# EAGLE board OSHW_STEPPER_DRIVER (EAGLE 6.2), part 1 of 3
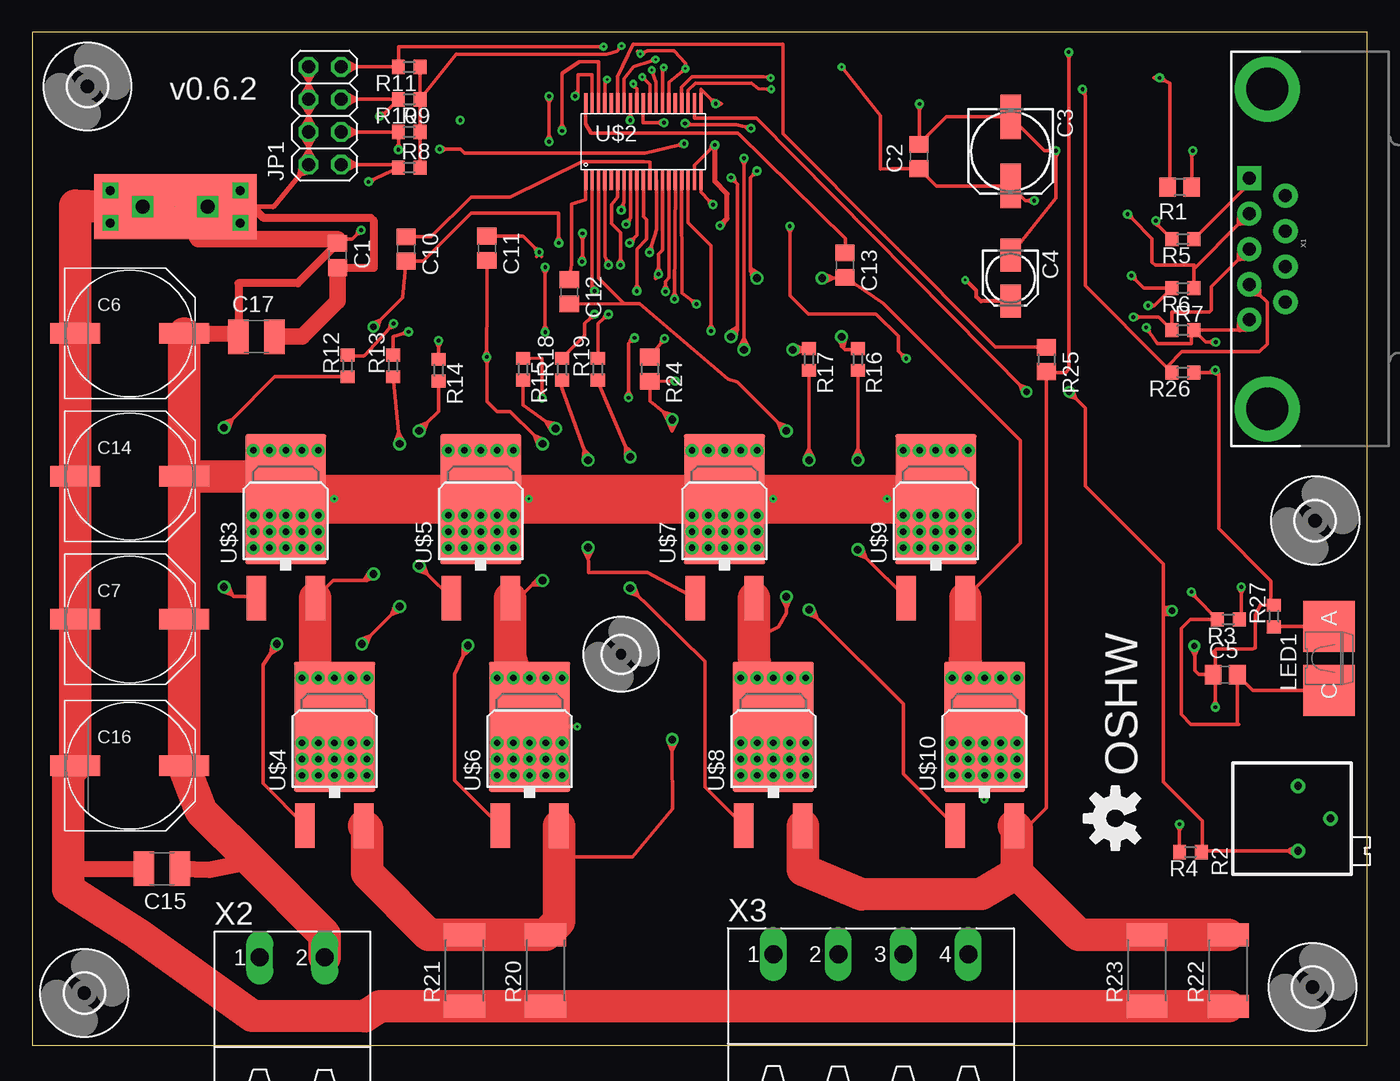
[diagram p1: board, top side]
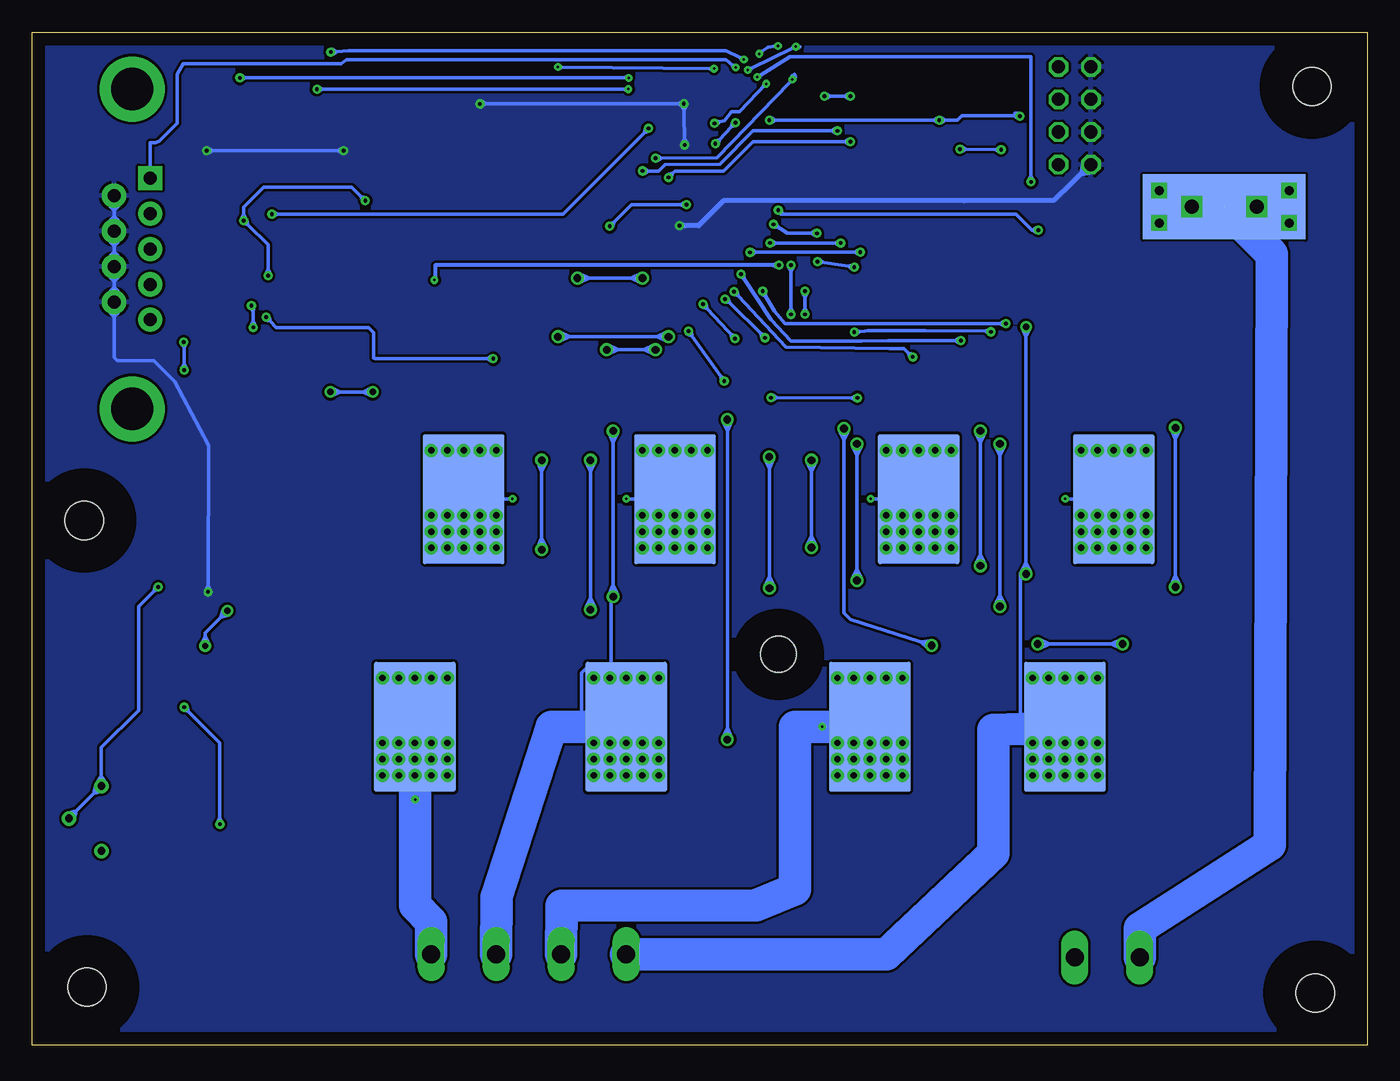
[diagram p2: board, bottom side, seen from below]

Size 104.37 x 79.19 mm. Coordinates in mm from the lower left corner, seen from the top.
Outline: 0.02,0 104.34,0 104.37,79.16 0,79.19 0.02,0
Copper layers (1*16): Top 0.035mm / dielectric 1.5mm / Bottom 0.035mm
Design rules: minimum track width 10mil, minimum drill 0.2mm, track to track 8mil, track to pad 8mil, pad to pad 8mil, via to via 8mil, smd to smd 8mil, copper to edge 40mil, drill to drill 8mil, minimum pad ring 10mil, minimum via ring 8mil, stop-mask expansion 4mil, vias tented up to drill 0mil, thermal gap 10mil
Net classes: 0 default: width 0.254 mm; 1 MOTOR POWER: width 0.254 mm, clearance 0.254 mm; 2 LSS (low impedance): width 0.254 mm, clearance 0.254 mm

## Footprints (pad centres in the part's own frame; a part is rotated, then mirrored left to right if it is on the bottom)
C0805 = smd 1.3 x 1.5: 1 -0.95,0; 2 0.95,0
153CLV-0605 = smd 3.5 x 1.6: + 2.7,0; - -2.7,0
153CLV-0405 = smd 2.6 x 1.6: + 1.8,0; - -1.8,0
PANASONIC_G = smd 3.9 x 1.6: + 4.25,0; - -4.25,0
C1210 = smd 1.6 x 2.7: 1 -1.4,0; 2 1.4,0
3,0 = hole 3: 0,0
2,8 = hole 2.8: 0,0
STARBOARD_GROUND = smd 0.635 x 1.27: 1 0,-5.08; 4 0,5.08 | smd 1.27 x 0.635: 2 0,0 | smd 5.08 x 12.7: P$1 0,0 | smd 5.08 x 12.7 bottom: P$2 0,0 | drill 0.7 square: P$3 1.27,5.08; P$4 -1.27,5.08; P$9 -1.27,-5.08; P$10 1.27,-5.08 | drill 1.1 square: P$5 0,2.54; P$6 0,-2.54
2X04 = drill 1.016 octagon: 1 -3.81,-1.27; 2 -3.81,1.27; 3 -1.27,-1.27; 4 -1.27,1.27; 5 1.27,-1.27; 6 1.27,1.27; 7 3.81,-1.27; 8 3.81,1.27
OSRAM-SIDELED = smd 4 x 4: A 0,2.5; C 0,-2.5
R0805 = smd 1.3 x 1.5: 1 -0.95,0; 2 0.95,0
RTRIM3296P = drill 0.61: 1 0,-2.54; 2 2.54,0; 3 0,2.54
R0603 = smd 1 x 1.1: 1 -0.85,0; 2 0.85,0
R2512 = smd 1.8 x 3.2: 1 -2.8,0; 2 2.8,0
TSSOP38 = smd 0.254 x 1.6: P$1 -4.5,-3; P$2 -4,-3; P$3 -3.5,-3; P$4 -3,-3; P$5 -2.5,-3; P$6 -2,-3; P$7 -1.5,-3; P$8 -1,-3; P$9 -0.5,-3; P$10 0,-3; P$11 0.5,-3; P$12 1,-3; P$13 1.5,-3; P$14 2,-3; P$15 2.5,-3; P$16 3,-3; P$17 3.5,-3; P$18 4,-3; P$19 4.5,-3; P$20 4.5,3; P$21 4,3; P$22 3.5,3; P$23 3,3; P$24 2.5,3; P$25 2,3; P$26 1.5,3; P$27 1,3; P$28 0.5,3; P$29 0,3; P$30 -0.5,3; P$31 -1,3; P$32 -1.5,3; P$33 -2,3; P$34 -2.5,3; P$35 -3,3; P$36 -3.5,3; P$37 -4,3; P$38 -4.5,3
D-PAK_TO252AA = smd 6.35 x 10.16: D 0,2.54 | smd 6.35 x 10.16 bottom: DRAIN-BOTTOM 0,2.54 | smd 1.6 x 3.5: G -2.3,-5.2; S 2.3,-5.2 | drill 0.5 pad 1: P$1 -1.27,6.35; P$2 -2.54,6.35; P$3 0,6.35; P$4 1.27,6.35; P$5 2.54,6.35; P$6 -2.54,1.27; P$7 -1.27,1.27; P$8 0,1.27; P$9 1.27,1.27; P$10 2.54,1.27; P$11 -2.54,0; P$12 -1.27,0; P$13 0,0; P$14 1.27,0; P$15 2.54,0; P$16 -2.54,-1.27; P$17 -1.27,-1.27; P$18 0,-1.27; P$19 1.27,-1.27; P$20 2.54,-1.27
DB9 = drill 1.016 pad 1.88 square: 1 -5.54,-1.42 | drill 1.016 pad 1.88: 2 -2.77,-1.42; 3 0,-1.42; 4 2.77,-1.42; 5 5.54,-1.42; 6 -4.15,1.42; 7 -1.38,1.42; 8 1.38,1.42; 9 4.15,1.42 | drill 3.302 pad 5.08: G1 -12.5,0; G2 12.5,0
MSTBA2 = drill 1.397 long: 1 -2.54,5.08; 2 2.54,5.08
MSTBA4 = drill 1.397 long: 1 -7.62,5.08; 2 -2.54,5.08; 3 2.54,5.08; 4 7.62,5.08

## Placement (x,y rotation side)
C1  100n  [C0805]  23.9,61.72 270 top
C2  100n  [C0805]  69.31,69.45 90 top
C3  100u  [153CLV-0605]  76.47,69.85 270 top
C4  1u  [153CLV-0405]  76.47,59.94 270 top
C5  100n  [C0805]  93.24,28.96 0 top
C6  100u (747-9090)  [PANASONIC_G]  7.64,55.63 0 top
C7  100u (747-9090)  [PANASONIC_G]  7.64,33.27 0 top
C10  10n  [C0805]  29.23,62.23 270 top
C11  10n  [C0805]  35.55,62.28 270 top
C12  10n  [C0805]  41.99,58.88 270 top
C13  10n  [C0805]  63.52,60.96 270 top
C14  100u (747-9090)  [PANASONIC_G]  7.64,44.45 0 top
C15  100n  [C1210]  10.16,13.79 180 top
C16  100u (747-9090)  [PANASONIC_G]  7.64,21.84 0 top
C17  100n  [C1210]  17.55,55.37 0 top
H1  MOUNT-HOLE3.0  [3,0]  100.06,4.54 0 top
H2  MOUNT-HOLE3.0  [3,0]  4.34,74.93 0 top
H3  MOUNT-HOLE3.0  [3,0]  4.09,4.08 0 top
H4  MOUNT-HOLE3.0  [3,0]  100.28,41 0 top
H5  MOUNT-HOLE2.8  [2,8]  46.04,30.55 0 top
J1  [STARBOARD_GROUND]  11.2,65.53 270 top
JP1  [2X04]  22.88,72.64 90 top
LED1  [OSRAM-SIDELED]  101.37,30.23 0 top
R1  10K 10ppm (662-1252)  [R0805]  89.68,67.06 180 top
R2  20K (522-0142)  [RTRIM3296P]  98.94,17.72 0 top
R3  10K  [R0603]  93.49,33.27 180 top
R4  22K  [R0603]  90.53,15.09 180 top
R5  10k  [R0603]  89.94,62.99 180 top
R6  10k  [R0603]  89.94,59.18 180 top
R7  10k  [R0603]  89.94,55.88 0 top
R8  10k  [R0603]  29.48,68.58 0 top
R9  10k  [R0603]  29.48,71.37 0 top
R10  10k  [R0603]  29.48,73.91 180 top
R11  10k  [R0603]  29.48,76.45 180 top
R12  33  [R0603]  24.66,53.09 90 top
R13  33  [R0603]  28.21,53.09 90 top
R14  33  [R0603]  31.79,52.75 270 top
R15  33  [R0603]  38.37,52.83 270 top
R16  33  [R0603]  64.54,53.59 270 top
R17  33  [R0603]  60.73,53.59 270 top
R18  33  [R0603]  41.42,52.83 90 top
R19  33  [R0603]  44.22,52.83 90 top
R20  0.1  [R2512]  40.15,5.84 90 top
R21  0.1  [R2512]  33.8,5.84 90 top
R22  0.1  [R2512]  93.49,5.84 90 top
R23  0.1  [R2512]  87.14,5.84 90 top
R24  0  [R0805]  48.28,52.83 270 top
R25  0  [R0805]  79.27,53.59 270 top
R26  10k  [R0603]  89.94,52.58 180 top
R27  180  [R0603]  97.05,33.53 90 top
U$1  OSHW-LOGOM  [OSHW-LOGO-M]  84.66,17.73 90 top
U$2  A4989  [TSSOP38]  47.77,70.61 0 top
U$3  IRLR024  [D-PAK_TO252AA]  19.83,40.13 0 top
U$4  IRLR024  [D-PAK_TO252AA]  23.64,22.35 0 top
U$5  IRLR024  [D-PAK_TO252AA]  35.07,40.13 0 top
U$6  IRLR024  [D-PAK_TO252AA]  38.88,22.35 0 top
U$7  IRLR024  [D-PAK_TO252AA]  54.12,40.13 0 top
U$8  IRLR024  [D-PAK_TO252AA]  57.93,22.35 0 top
U$9  IRLR024  [D-PAK_TO252AA]  70.63,40.13 0 top
U$10  IRLR024  [D-PAK_TO252AA]  74.44,22.35 0 top
X1  [DB9]  96.54,62.23 270 top
X2  MSTBA2  [MSTBA2]  20.34,1.78 0 top
X3  MSTBA4  [MSTBA4]  65.55,2.03 0 top

## Tracks (layer width: path | path; a pad name or v marks a point on that pad's centre or on a via)
C1A
  Top 0.254: C10.1 31.2,63.18 34.31,66.29 37.36,66.29 43,69.05 47.82,69.05 48.28,68.99 U$2.P$11
C1B  (via drill 0.3)
  Top 0.254: C11.1 38.37,63.23 39.32,62.29 | 39.32,62.29 | 39.32,62.29 v39.64,61.98 | v48.27,61.96 48.79,63.75 48.79,67.6 U$2.P$12 | 39.32,62.29 39.43,61.92 | 39.43,61.92 | 39.32,62.29 | 39.32,62.29 39.43,61.92 | v39.64,61.98 39.43,61.92 | 39.32,62.29 39.7,62.2 | v39.64,61.98 39.7,62.2 | v39.64,61.98 39.45,61.64 | v39.64,61.98 39.84,61.64 | 39.32,62.29 | 39.32,62.29 39.43,61.92 | 39.32,62.29 39.7,62.2 | 39.32,62.29 39.43,61.92 | v39.64,61.98 39.43,61.92 | 39.32,62.29 39.7,62.2 | v39.64,61.98 39.7,62.2 | v48.27,61.96 48.11,62.13 48.39,62.39 48.49,62.02 v48.27,61.96
  Bottom 0.254: v39.64,61.98 40.09,61.98 | 40.09,61.98 v48.27,61.96 | 40.09,61.98 39.76,62.17 v39.64,61.98 | 40.09,61.98 39.76,61.78 v39.64,61.98 | v48.27,61.96 48.15,61.77 47.82,61.96 48.15,62.16 v48.27,61.96
C2A
  Top 0.254: C12.1 42.18,60.99 42.18,65.74 43.27,66.09 U$2.P$1
C2B
  Top 0.254: C13.1 63.56,63.04 55.16,71.27 43.7,71.26 43.27,72.04 43.27,72.64 U$2.P$38
DIR  (via drill 0.2, 0.3)
  Top 0.254: U$2.P$30 47.27,74.76 47.13,74.87 | 47.13,74.87 46.97,75 v46.99,75.14 | v51.04,72.04 51.35,71.94 51.48,71.94 | 51.48,71.94 55.07,71.94 v56.2,71.65 | v85.62,64.95 85.94,64.63 | 85.94,64.63 87.52,63.05 87.52,61.2 87.77,60.95 90.82,60.95 90.79,60.92 90.79,60.67 | 90.79,60.67 R6.1 | X1.2 94.4,64.28 90.79,60.67 | 46.91,74.98 | 47.13,74.87 | 47.13,74.87 | 47.13,74.87 46.91,74.98 | 46.91,74.98 | 47.13,74.87 46.91,74.98 | 46.91,74.98 | 47.13,74.87 47.16,75.11 | 47.16,75.11 | v46.99,75.14 47.16,75.11 | 47.13,74.87 46.91,74.98 | v46.99,75.14 46.91,74.98 | 47.13,74.87 47.16,75.11 | v46.99,75.14 47.16,75.11 | 47.13,74.87 46.91,74.98 | v46.99,75.14 46.91,74.98 | 51.48,71.94 51.19,72.2 v51.04,72.04 | 51.48,71.94 51.11,71.82 v51.04,72.04 | v56.2,71.65 56.04,71.49 55.76,71.76 56.14,71.87 v56.2,71.65 | 85.94,64.63 85.84,65.01 v85.62,64.95 | 85.94,64.63 85.56,64.73 v85.62,64.95
  Top 0.508: 94.4,64.28 95.15,64.31 X1.2 94.44,65.03 94.4,64.28
  Bottom 0.254: v46.99,75.14 49.07,72.95 49.72,72.95 50.26,72.26 50.61,72.16 | 50.61,72.16 v51.04,72.04 | v56.2,71.65 56.52,71.33 | 56.52,71.33 62.87,64.95 85.17,64.95 | 85.17,64.95 | 85.17,64.95 v85.62,64.95 | 50.61,72.16 50.98,72.26 | 50.98,72.26 | v46.99,75.14 47.17,75.16 47.2,74.92 46.96,74.97 v46.99,75.14 | 50.61,72.16 50.88,71.88 v51.04,72.04 | 50.61,72.16 50.98,72.26 | v51.04,72.04 50.98,72.26 | 56.52,71.33 56.42,71.71 v56.2,71.65 | 56.52,71.33 56.14,71.43 v56.2,71.65 | 85.17,64.95 85.51,65.15 | 85.17,64.95 | 85.17,64.95 85.51,64.75 | v85.62,64.95 85.51,64.75 | 85.17,64.95 85.51,65.15 | 85.17,64.95 | 85.17,64.95 85.51,64.75 | 85.17,64.95 | 85.17,64.95 85.51,65.15 | v85.62,64.95 85.51,65.15 | 85.17,64.95 85.51,64.75 | v85.62,64.95 85.51,64.75 | 85.17,64.95 85.51,65.15 | v85.62,64.95 85.51,65.15 | 85.17,64.95 85.51,64.75 | 85.17,64.95 85.51,65.15 | 85.17,64.95 85.51,64.75 | v85.62,64.95 85.51,64.75 | 85.17,64.95 85.51,65.15 | v85.62,64.95 85.51,65.15
ENABLE  (via drill 0.3)
  Top 0.254: U$2.P$19 52.27,66.65 52.9,66.02 | 52.9,66.02 v53.22,65.7 | v59.22,64 59.22,63.55 | 59.22,63.55 | 59.22,63.55 59.22,58.6 60.67,57.15 65.97,57.15 67.72,55.4 67.72,54.25 68,53.97 | X1.3 94.4,61.51 92.17,59.28 92.17,57.45 92.02,57.3 89.07,57.3 89.09,57.28 R7.1 88.12,56.85 88.04,56.91 87.77,56.9 86.52,56.9 | 86.52,56.9 | 86.52,56.9 v86.07,56.9 | v68.32,53.65 68,53.97 | 52.9,66.02 53,65.64 v53.22,65.7 | 52.9,66.02 53.28,65.92 v53.22,65.7 | 59.22,63.55 59.42,63.89 | 59.22,63.55 | 59.22,63.55 59.42,63.89 | v59.22,64 59.42,63.89 | 59.22,63.55 | 59.22,63.55 59.02,63.89 | 59.22,63.55 59.42,63.89 | 59.22,63.55 | 59.22,63.55 59.02,63.89 | v59.22,64 59.02,63.89 | 59.22,63.55 59.42,63.89 | 59.22,63.55 59.02,63.89 | 59.22,63.55 59.42,63.89 | v59.22,64 59.42,63.89 | 59.22,63.55 59.02,63.89 | v59.22,64 59.02,63.89 | 59.22,63.55 59.42,63.89 | v59.22,64 59.42,63.89 | 59.22,63.55 59.02,63.89 | v59.22,64 59.02,63.89 | 86.52,56.9 86.18,57.1 | 86.52,56.9 | 86.52,56.9 86.18,57.1 | v86.07,56.9 86.18,57.1 | 86.52,56.9 | 86.52,56.9 86.18,56.7 | 86.52,56.9 86.18,57.1 | 86.52,56.9 | 86.52,56.9 86.18,56.7 | v86.07,56.9 86.18,56.7 | 86.52,56.9 86.18,57.1 | 86.52,56.9 86.18,56.7 | 86.52,56.9 86.18,57.1 | v86.07,56.9 86.18,57.1 | 86.52,56.9 86.18,56.7 | v86.07,56.9 86.18,56.7 | 86.52,56.9 86.18,57.1 | v86.07,56.9 86.18,57.1 | 86.52,56.9 86.18,56.7 | v86.07,56.9 86.18,56.7 | 68,53.97 68.1,53.59 v68.32,53.65 | 68,53.97 68.38,53.87 v68.32,53.65
  Top 0.508: 94.4,61.51 95.15,61.55 X1.3 94.44,62.26 94.4,61.51
  Bottom 0.254: v53.22,65.7 53.67,65.7 | 53.67,65.7 | 53.67,65.7 57.52,65.7 58.9,64.32 | 58.9,64.32 v59.22,64 | v86.07,56.9 85.75,56.58 | 85.75,56.58 85.27,56.1 78.07,56.1 77.67,55.7 77.67,53.7 77.57,53.65 68.77,53.65 | 68.77,53.65 | 68.77,53.65 v68.32,53.65 | 53.67,65.7 53.33,65.9 | 53.67,65.7 | 53.67,65.7 53.33,65.9 | v53.22,65.7 53.33,65.9 | 53.67,65.7 | 53.67,65.7 53.33,65.5 | 53.67,65.7 53.33,65.9 | 53.67,65.7 | 53.67,65.7 53.33,65.5 | v53.22,65.7 53.33,65.5 | 53.67,65.7 53.33,65.9 | 53.67,65.7 53.33,65.5 | 53.67,65.7 53.33,65.9 | v53.22,65.7 53.33,65.9 | 53.67,65.7 53.33,65.5 | v53.22,65.7 53.33,65.5 | 53.67,65.7 53.33,65.9 | v53.22,65.7 53.33,65.9 | 53.67,65.7 53.33,65.5 | v53.22,65.7 53.33,65.5 | 58.9,64.32 59,63.94 v59.22,64 | 58.9,64.32 59.28,64.22 v59.22,64 | 85.75,56.58 86.13,56.68 v86.07,56.9 | 85.75,56.58 85.85,56.96 v86.07,56.9 | 68.77,53.65 68.43,53.85 | 68.77,53.65 | 68.77,53.65 68.43,53.85 | v68.32,53.65 68.43,53.85 | 68.77,53.65 | 68.77,53.65 68.43,53.45 | 68.77,53.65 68.43,53.85 | 68.77,53.65 | 68.77,53.65 68.43,53.45 | v68.32,53.65 68.43,53.45 | 68.77,53.65 68.43,53.85 | 68.77,53.65 68.43,53.45 | 68.77,53.65 68.43,53.85 | v68.32,53.65 68.43,53.85 | 68.77,53.65 68.43,53.45 | v68.32,53.65 68.43,53.45 | 68.77,53.65 68.43,53.85 | v68.32,53.65 68.43,53.85 | 68.77,53.65 68.43,53.45 | v68.32,53.65 68.43,53.45
GH1A  (via drill 0.3)
  Top 0.254: 27.96,56.05 25.99,53.91 26.18,54.1 25.93,53.85 24.66,53.85 R12.2 | 27.96,56.05 v28.26,56.38 | v47.26,58.93 47.26,59.38 | 47.26,59.38 | 47.26,59.38 47.26,62.23 48.03,62.99 48.03,64.52 47.77,64.77 U$2.P$10 | 47.26,59.38 47.46,59.04 | 47.26,59.38 | 47.26,59.38 47.07,59.04 | v47.26,58.93 47.07,59.04 | 47.26,59.38 47.46,59.04 | 47.26,59.38 | 47.26,59.38 47.07,59.04 | 47.26,59.38 | 47.26,59.38 47.46,59.04 | v47.26,58.93 47.46,59.04 | 47.26,59.38 47.07,59.04 | v47.26,58.93 47.07,59.04 | 47.26,59.38 47.46,59.04 | v47.26,58.93 47.46,59.04 | 47.26,59.38 47.07,59.04 | 47.26,59.38 47.46,59.04 | 47.26,59.38 47.07,59.04 | v47.26,58.93 47.07,59.04 | 47.26,59.38 47.46,59.04 | v47.26,58.93 47.46,59.04 | 27.96,56.05 28.33,56.17 v28.26,56.38 | 27.96,56.05 28.04,56.43 v28.26,56.38
  Bottom 0.254: v47.26,58.93 46.33,57.38 45.51,56.38 28.71,56.38 | v28.26,56.38 28.71,56.38 | 28.71,56.38 | 47.04,58.93 | 47.03,58.54 47.37,58.73 | 47.03,58.54 | 47.03,58.54 47.04,58.93 | v47.26,58.93 47.04,58.93 | 47.03,58.54 47.37,58.73 | v47.26,58.93 47.37,58.73 | 47.03,58.54 47.04,58.93 | v47.26,58.93 47.04,58.93 | 28.71,56.38 28.37,56.58 | 28.71,56.38 | 28.71,56.38 28.37,56.58 | v28.26,56.38 28.37,56.58 | 28.71,56.38 | 28.71,56.38 28.37,56.19 | 28.71,56.38 28.37,56.58 | 28.71,56.38 | 28.71,56.38 28.37,56.19 | v28.26,56.38 28.37,56.19 | 28.71,56.38 28.37,56.58 | 28.71,56.38 28.37,56.19 | 28.71,56.38 28.37,56.58 | v28.26,56.38 28.37,56.58 | 28.71,56.38 28.37,56.19 | v28.26,56.38 28.37,56.19 | 28.71,56.38 28.37,56.58 | v28.26,56.38 28.37,56.58 | 28.71,56.38 28.37,56.19 | v28.26,56.38 28.37,56.19
GH1B  (via drill 0.3)
  Top 0.254: U$2.P$13 49.27,62.12 48.97,61.82 48.97,60.72 | 48.97,60.72 v48.96,60.27 | v31.77,55.06 31.78,54.61 | 31.78,54.61 R14.1 | 31.78,54.61 31.97,54.95 | 31.97,54.95 | 49.16,60.38 | 31.78,54.61 31.97,54.95 | v31.77,55.06 31.97,54.95 | 31.78,54.61 31.58,54.94 v31.77,55.06 | v48.96,60.27 49.06,60.07 48.72,59.9 48.74,60.28 v48.96,60.27 | 48.97,60.72 48.77,60.39 | 48.97,60.72 | 48.97,60.72 49.16,60.38 | v48.96,60.27 49.16,60.38 | 48.97,60.72 48.77,60.39 | v48.96,60.27 48.77,60.39 | 48.97,60.72 49.16,60.38 | v48.96,60.27 49.16,60.38
  Bottom 0.254: v48.96,60.27 48.72,59.9 | 48.72,59.9 46.63,56.7 45.07,55.04 39.55,55.02 37.42,55.08 v31.77,55.06 | 32.22,55.06 31.88,54.87 | v31.77,55.06 31.88,54.87 | 32.22,55.06 31.88,55.26 v31.77,55.06 | 32.22,55.06 31.88,54.87 | v31.77,55.06 31.88,54.87 | 48.72,59.9 | 48.72,59.9 49.06,60.07 | 49.06,60.07 | 48.72,59.9 | 48.72,59.9 48.74,60.28 | 48.74,60.28 | 48.72,59.9 49.06,60.07 | 49.06,60.07 | v48.96,60.27 49.06,60.07 | 48.72,59.9 48.74,60.28 | v48.96,60.27 48.74,60.28 | 48.72,59.9 49.06,60.07 | v48.96,60.27 49.06,60.07 | 48.72,59.9 48.74,60.28 | v48.96,60.27 48.74,60.28
GH2A  (via drill 0.3)
  Top 0.254: U$2.P$2 43.77,59.34 | 43.77,59.34 43.77,59.12 v43.96,58.93 | v43.96,57.12 43.64,56.81 | 43.64,56.81 | 43.64,56.81 43.2,56.39 43.2,55.46 R18.2 | 43.64,56.81 | 43.64,56.81 | 43.64,56.81 43.75,57.18 | 43.75,57.18 | 43.64,56.81 44.02,56.9 | 44.02,56.9 | 43.64,56.81 | 43.64,56.81 44.02,56.9 | 44.02,56.9 | 43.64,56.81 | 43.64,56.81 | 43.64,56.81 44.02,56.9 | 44.02,56.9 | 43.64,56.81 | 43.75,57.18 | v43.96,57.12 43.75,57.18 | 43.77,59.34 43.74,58.95 v43.96,58.93 | 43.77,59.34 44.09,59.11 v43.96,58.93 | 43.64,56.81 43.75,57.18 | 43.64,56.81 43.75,57.18 | 43.75,57.18 | 43.64,56.81 43.75,57.18 | 43.75,57.18 | 43.64,56.81 43.75,57.18 | v43.96,57.12 43.75,57.18 | 43.64,56.81 44.02,56.9 | 43.64,56.81 43.75,57.18 | 43.64,56.81 44.02,56.9 | 44.02,56.9 | v43.96,57.12 44.02,56.9 | 43.64,56.81 43.75,57.18 | v43.96,57.12 43.75,57.18 | 43.64,56.81 44.02,56.9 | v43.96,57.12 44.02,56.9 | 43.64,56.81 43.75,57.18 | v43.96,57.12 43.75,57.18
  Bottom 0.254: v43.96,58.93 43.96,58.48 | 43.96,58.48 | 43.96,58.48 43.96,57.57 | 43.96,57.57 | 43.96,57.57 v43.96,57.12 | 43.96,58.48 44.16,58.81 | 43.96,58.48 | 43.96,58.48 44.16,58.81 | v43.96,58.93 44.16,58.81 | 43.96,58.48 | 43.96,58.48 43.77,58.81 | 43.96,58.48 44.16,58.81 | 43.96,58.48 | 43.96,58.48 43.77,58.81 | v43.96,58.93 43.77,58.81 | 43.96,58.48 44.16,58.81 | 43.96,58.48 43.77,58.81 | 43.96,58.48 44.16,58.81 | v43.96,58.93 44.16,58.81 | 43.96,58.48 43.77,58.81 | v43.96,58.93 43.77,58.81 | 43.96,58.48 44.16,58.81 | v43.96,58.93 44.16,58.81 | 43.96,58.48 43.77,58.81 | v43.96,58.93 43.77,58.81 | 43.96,57.57 44.16,57.23 | 43.96,57.57 | 43.96,57.57 43.77,57.23 | v43.96,57.12 43.77,57.23 | 43.96,57.57 44.16,57.23 | 43.96,57.57 | 43.96,57.57 43.77,57.23 | 43.96,57.57 | 43.96,57.57 44.16,57.23 | v43.96,57.12 44.16,57.23 | 43.96,57.57 43.77,57.23 | v43.96,57.12 43.77,57.23 | 43.96,57.57 44.16,57.23 | v43.96,57.12 44.16,57.23 | 43.96,57.57 43.77,57.23 | 43.96,57.57 44.16,57.23 | 43.96,57.57 43.77,57.23 | v43.96,57.12 43.77,57.23 | 43.96,57.57 44.16,57.23 | v43.96,57.12 44.16,57.23
GH2B  (via drill 0.3, 0.6)
  Top 0.254: v40.41,70.61 40.41,71.06 | 40.41,71.06 | 40.41,71.06 40.41,73.72 | 40.41,73.72 | 40.41,73.72 v40.41,74.17 | 54.95,67.5 55.14,67.31 55.14,56.12 | 54.95,67.5 v54.63,67.82 | 55.14,56.12 55.14,55.88 v54.63,55.37 | v63.27,55.37 63.27,54.61 63.4,54.48 | 63.4,54.48 63.52,54.36 64.54,54.36 R16.1 | U$2.P$37 43.77,75.65 43.75,75.84 42.68,75.83 42.68,75.73 42.69,74.54 | 42.69,74.54 42.69,74.42 v42.44,74.17 | 42.69,74.54 42.34,74.37 v42.44,74.17 | 42.69,74.54 42.66,74.15 v42.44,74.17 | 40.41,73.72 40.6,74.05 | 40.41,73.72 | 40.41,73.72 40.6,74.05 | v40.41,74.17 40.6,74.05 | 40.41,73.72 | 40.41,73.72 40.21,74.05 | 40.41,73.72 40.6,74.05 | 40.41,73.72 | 40.41,73.72 40.21,74.05 | v40.41,74.17 40.21,74.05 | 40.41,73.72 40.6,74.05 | 40.41,73.72 40.21,74.05 | 40.41,73.72 40.6,74.05 | v40.41,74.17 40.6,74.05 | 40.41,73.72 40.21,74.05 | v40.41,74.17 40.21,74.05 | 40.41,73.72 40.6,74.05 | v40.41,74.17 40.6,74.05 | 40.41,73.72 40.21,74.05 | v40.41,74.17 40.21,74.05 | 40.41,71.06 40.6,70.73 | 40.41,71.06 | 40.41,71.06 40.21,70.73 | v40.41,70.61 40.21,70.73 | 40.41,71.06 40.6,70.73 | 40.41,71.06 | 40.41,71.06 40.21,70.73 | 40.41,71.06 | 40.41,71.06 40.6,70.73 | v40.41,70.61 40.6,70.73 | 40.41,71.06 40.21,70.73 | v40.41,70.61 40.21,70.73 | 40.41,71.06 40.6,70.73 | v40.41,70.61 40.6,70.73 | 40.41,71.06 40.21,70.73 | 40.41,71.06 40.6,70.73 | 40.41,71.06 40.21,70.73 | v40.41,70.61 40.21,70.73 | 40.41,71.06 40.6,70.73 | v40.41,70.61 40.6,70.73 | 54.95,67.5 54.85,67.88 v54.63,67.82 | 54.95,67.5 54.57,67.6 v54.63,67.82 | 55.14,56.12 54.44,55.7 v54.63,55.37 | 55.14,56.12 55,55.31 v54.63,55.37 | 63.4,54.48 | 63.4,54.48 63.63,55.27 | 63.63,55.27 | v63.27,55.37 63.63,55.27 | 63.4,54.48 62.95,55.17
  Top 0.254: v63.27,55.37 62.95,55.17 | 63.4,54.48 63.63,55.27 | v63.27,55.37 63.63,55.27 | 63.4,54.48 62.95,55.17 | v63.27,55.37 62.95,55.17
  Bottom 0.254: v40.41,74.17 40.86,74.17 | 40.86,74.17 | 40.86,74.17 41.99,74.17 | 41.99,74.17 | 41.99,74.17 v42.44,74.17 | 40.86,70.61 48.03,70.61 50.31,68.33 54.12,68.33 54.31,68.14 | 40.86,70.61 | 40.86,70.61 v40.41,70.61 | v54.63,67.82 54.31,68.14 | v63.27,55.37 62.37,55.37 | 62.37,55.37 55.53,55.37 | 55.53,55.37 v54.63,55.37 | 55.53,55.37 54.79,55.03 | 62.37,55.37 63.11,55.03 | 54.79,55.71 | 54.79,55.03 | 63.11,55.03 | 41.99,74.17 42.32,74.36 | 41.99,74.17 | 41.99,74.17 42.32,73.97 | v42.44,74.17 42.32,73.97 | 41.99,74.17 42.32,74.36 | 41.99,74.17 | 41.99,74.17 42.32,73.97 | 41.99,74.17 | 41.99,74.17 42.32,74.36 | v42.44,74.17 42.32,74.36 | 41.99,74.17 42.32,73.97 | v42.44,74.17 42.32,73.97 | 41.99,74.17 42.32,74.36 | v42.44,74.17 42.32,74.36 | 41.99,74.17 42.32,73.97 | 41.99,74.17 42.32,74.36 | 41.99,74.17 42.32,73.97 | v42.44,74.17 42.32,73.97 | 41.99,74.17 42.32,74.36 | v42.44,74.17 42.32,74.36 | 40.86,74.17 40.52,74.36 | 40.86,74.17 | 40.86,74.17 40.52,74.36 | v40.41,74.17 40.52,74.36 | 40.86,74.17 | 40.86,74.17 40.52,73.97 | 40.86,74.17 40.52,74.36 | 40.86,74.17 | 40.86,74.17 40.52,73.97 | v40.41,74.17 40.52,73.97 | 40.86,74.17 40.52,74.36 | 40.86,74.17 40.52,73.97 | 40.86,74.17 40.52,74.36 | v40.41,74.17 40.52,74.36 | 40.86,74.17 40.52,73.97 | v40.41,74.17 40.52,73.97 | 40.86,74.17 40.52,74.36 | v40.41,74.17 40.52,74.36 | 40.86,74.17 40.52,73.97 | v40.41,74.17 40.52,73.97 | 40.86,70.61 40.52,70.81 | 40.86,70.61 | 40.86,70.61 40.52,70.81 | v40.41,70.61 40.52,70.81 | 40.86,70.61 | 40.86,70.61 40.52,70.42 | 40.86,70.61 40.52,70.81 | 40.86,70.61 | 40.86,70.61 40.52,70.42 | v40.41,70.61 40.52,70.42 | 40.86,70.61 40.52,70.81 | 40.86,70.61 40.52,70.42 | 40.86,70.61 40.52,70.81 | v40.41,70.61 40.52,70.81
  Bottom 0.254: 40.86,70.61 40.52,70.42 | v40.41,70.61 40.52,70.42 | 40.86,70.61 40.52,70.81 | v40.41,70.61 40.52,70.81 | 40.86,70.61 40.52,70.42 | v40.41,70.61 40.52,70.42 | 54.31,68.14 54.41,67.76 v54.63,67.82 | 54.31,68.14 54.69,68.04 v54.63,67.82 | 55.53,55.37 54.79,55.71 | 55.53,55.37 | 55.53,55.37 | 55.53,55.37 54.79,55.71 | v54.63,55.37 54.79,55.71 | 55.53,55.37 | 55.53,55.37 54.79,55.03 | v54.63,55.37 54.79,55.03 | 55.53,55.37 54.79,55.71 | 55.53,55.37 54.79,55.03 | 55.53,55.37 54.79,55.71 | v54.63,55.37 54.79,55.71 | 55.53,55.37 54.79,55.03 | v54.63,55.37 54.79,55.03 | 62.37,55.37 | 62.37,55.37 | 62.37,55.37 63.11,55.03 | v63.27,55.37 63.11,55.03 | 62.37,55.37 | 62.37,55.37 63.11,55.71 | 62.37,55.37 63.11,55.03 | 62.37,55.37 63.11,55.71 | 63.11,55.71 | 62.37,55.37 63.11,55.03 | 63.11,55.03 | v63.27,55.37 63.11,55.03 | 62.37,55.37 63.11,55.71 | v63.27,55.37 63.11,55.71 | 62.37,55.37 63.11,55.03 | v63.27,55.37 63.11,55.03 | 62.37,55.37 63.11,55.71 | v63.27,55.37 63.11,55.71
GL1A  (via drill 0.3)
  Top 0.254: v40.11,55.73 40.11,56.18 | 40.11,56.18 | 40.11,56.18 40.11,60.35 | 40.11,60.35 | 40.11,60.35 v40.11,60.8 | 29,55.61 28.23,55.37 28.22,54.95 R13.2 | 29,55.61 v29.43,55.75 | v46.41,64.15 46.54,64.37 46.78,64.62 U$2.P$8 | v43.02,63.45 43.02,63 | 43.02,63 | 43.02,63 43.02,61.7 | 43.02,61.7 43.02,61.08 v42.99,61.25 | 29,55.61 29.26,55.9 | v29.43,55.75 29.26,55.9 | 46.32,64.36 | 40.11,60.35 40.31,60.69 | 40.11,60.35 | 40.11,60.35 40.31,60.69 | v40.11,60.8 40.31,60.69 | 40.11,60.35 | 40.11,60.35 39.91,60.69 | 40.11,60.35 40.31,60.69 | 40.11,60.35 | 40.11,60.35 39.91,60.69 | v40.11,60.8 39.91,60.69 | 40.11,60.35 40.31,60.69 | 40.11,60.35 39.91,60.69 | 40.11,60.35 40.31,60.69 | v40.11,60.8 40.31,60.69 | 40.11,60.35 39.91,60.69 | v40.11,60.8 39.91,60.69 | 40.11,60.35 40.31,60.69 | v40.11,60.8 40.31,60.69 | 40.11,60.35 39.91,60.69 | v40.11,60.8 39.91,60.69 | 40.11,56.18 40.31,55.84 | 40.11,56.18 | 40.11,56.18 39.91,55.84 | v40.11,55.73 39.91,55.84 | 40.11,56.18 40.31,55.84 | 40.11,56.18 | 40.11,56.18 39.91,55.84 | 40.11,56.18 | 40.11,56.18 40.31,55.84 | v40.11,55.73 40.31,55.84 | 40.11,56.18 39.91,55.84 | v40.11,55.73 39.91,55.84 | 40.11,56.18 40.31,55.84 | v40.11,55.73 40.31,55.84 | 40.11,56.18 39.91,55.84 | 40.11,56.18 40.31,55.84 | 40.11,56.18 39.91,55.84 | v40.11,55.73 39.91,55.84 | 40.11,56.18 40.31,55.84 | v40.11,55.73 40.31,55.84 | 29,55.61 29.38,55.53 v29.43,55.75 | 29,55.61 29.26,55.9 | v29.43,55.75 29.26,55.9 | 46.68,64.51 46.32,64.36 | v46.41,64.15 46.32,64.36 | 46.68,64.51 46.32,64.36 | v46.41,64.15 46.32,64.36 | 46.68,64.51 46.64,64.13 v46.41,64.15 | 43.02,63 43.22,63.34 | 43.02,63 | 43.02,63 43.22,63.34 | v43.02,63.45 43.22,63.34 | 43.02,63 | 43.02,63 42.82,63.34 | 43.02,63 43.22,63.34
  Top 0.254: 43.02,63 | 43.02,63 42.82,63.34 | v43.02,63.45 42.82,63.34 | 43.02,63 43.22,63.34 | 43.02,63 42.82,63.34 | 43.02,63 43.22,63.34 | v43.02,63.45 43.22,63.34 | 43.02,63 42.82,63.34 | v43.02,63.45 42.82,63.34 | 43.02,63 43.22,63.34 | v43.02,63.45 43.22,63.34 | 43.02,63 42.82,63.34 | v43.02,63.45 42.82,63.34 | 43.02,61.7 42.8,61.38 v42.99,61.25 | 43.02,61.7 43.19,61.35 v42.99,61.25
  Bottom 0.254: v40.11,60.8 40.55,60.87 | 40.55,60.87 v42.99,61.25 | 39.66,55.77 39.29,55.81 39.03,55.83 34.56,55.83 29.88,55.81 | 39.66,55.77 v40.11,55.73 | 29.88,55.81 29.63,55.81 v29.43,55.75 | v43.02,63.45 43.47,63.45 | 43.47,63.45 | 43.47,63.45 45.32,63.45 v46.41,64.15 | v42.99,61.25 43.02,61 | 42.91,61.04 | 40.55,60.87 40.19,61.01 v40.11,60.8 | 40.55,60.87 40.25,60.62 v40.11,60.8 | 39.66,55.77 39.98,55.55 v40.11,55.73 | 39.66,55.77 40.02,55.94 v40.11,55.73 | 29.88,55.81 29.52,55.96 v29.43,55.75 | 29.88,55.81 29.57,55.57 v29.43,55.75 | 46.21,64.25 | v46.41,64.15 46.21,64.25 | v46.41,64.15 46.42,63.92 46.03,63.91 46.21,64.25 | v46.41,64.15 46.21,64.25 | 43.47,63.45 43.13,63.65 | 43.47,63.45 | 43.47,63.45 43.13,63.65 | v43.02,63.45 43.13,63.65 | 43.47,63.45 | 43.47,63.45 43.13,63.25 | 43.47,63.45 43.13,63.65 | 43.47,63.45 | 43.47,63.45 43.13,63.25 | v43.02,63.45 43.13,63.25 | 43.47,63.45 43.13,63.65 | 43.47,63.45 43.13,63.25 | 43.47,63.45 43.13,63.65 | v43.02,63.45 43.13,63.65 | 43.47,63.45 43.13,63.25 | v43.02,63.45 43.13,63.25 | 43.47,63.45 43.13,63.65 | v43.02,63.45 43.13,63.65 | 43.47,63.45 43.13,63.25 | v43.02,63.45 43.13,63.25 | 42.55,61.18 42.91,61.04 | v42.99,61.25 42.91,61.04 | 42.55,61.18 42.91,61.04 | v42.99,61.25 42.91,61.04 | 42.55,61.18 42.85,61.43 v42.99,61.25
GL1B  (via drill 0.3)
  Top 0.254: U$2.P$15 v50.2,58.32 | 46.62,51.05 46.62,54.85 46.75,54.98 | 46.62,51.05 | 46.62,51.05 v46.62,50.6 | v39.87,50.59 39.87,51.04 | 39.87,51.04 | 39.87,51.04 39.87,53.65 R15.1 | v47.09,55.28 47.05,55.28 46.75,54.98 | 46.75,54.98 47.13,55.06 | 46.75,54.98 46.88,55.35 | v47.09,55.28 46.88,55.35 | 46.75,54.98 47.13,55.06 | 47.13,55.06 | 46.62,51.05 46.82,50.71 | 46.62,51.05 | 46.62,51.05 46.42,50.71 | v46.62,50.6 46.42,50.71 | 46.62,51.05 46.82,50.71 | 46.62,51.05 | 46.62,51.05 46.42,50.71 | 46.62,51.05 | 46.62,51.05 46.82,50.71 | v46.62,50.6 46.82,50.71 | 46.62,51.05 46.42,50.71 | v46.62,50.6 46.42,50.71 | 46.62,51.05 46.82,50.71 | v46.62,50.6 46.82,50.71 | 46.62,51.05 46.42,50.71 | 46.62,51.05 46.82,50.71 | 46.62,51.05 46.42,50.71 | v46.62,50.6 46.42,50.71 | 46.62,51.05 46.82,50.71 | v46.62,50.6 46.82,50.71 | 39.87,51.04 40.07,50.7 | 39.87,51.04 | 39.87,51.04 39.67,50.7 | v39.87,50.59 39.67,50.7 | 39.87,51.04 40.07,50.7 | 39.87,51.04 | 39.87,51.04 39.67,50.7 | 39.87,51.04 | 39.87,51.04 40.07,50.7 | v39.87,50.59 40.07,50.7 | 39.87,51.04 39.67,50.7 | v39.87,50.59 39.67,50.7 | 39.87,51.04 40.07,50.7 | v39.87,50.59 40.07,50.7 | 39.87,51.04 39.67,50.7 | 39.87,51.04 40.07,50.7 | 39.87,51.04 39.67,50.7 | v39.87,50.59 39.67,50.7 | 39.87,51.04 40.07,50.7 | v39.87,50.59 40.07,50.7 | 50.2,58.77 50.01,58.44 | v50.2,58.32 50.01,58.44 | 50.2,58.77 50.01,58.44 | v50.2,58.32 50.01,58.44 | 50.2,58.77 50.4,58.43 v50.2,58.32 | 46.75,54.98 | 46.75,54.98 47.13,55.06 | v47.09,55.28 47.13,55.06 | 46.75,54.98 | 47.13,55.06 | 46.75,54.98 46.88,55.35 | 46.88,55.35 | 46.75,54.98 47.13,55.06 | v47.09,55.28 47.13,55.06 | 46.75,54.98 46.88,55.35 | v47.09,55.28 46.88,55.35 | 46.75,54.98 47.13,55.06 | v47.09,55.28 47.13,55.06
  Top 0.254: 46.75,54.98 46.88,55.35 | v47.09,55.28 46.88,55.35
  Bottom 0.254: v46.62,50.6 40.32,50.59 | 40.32,50.59 v39.87,50.59 | v50.2,58.32 49.86,58.03 | 49.86,58.03 | 49.86,58.03 49.74,57.93 47.41,55.6 | 47.41,55.6 v47.09,55.28 | 49.86,58.03 | 49.86,58.03 | 49.86,58.03 | 49.86,58.03 50.24,58.1 | 49.86,58.03 | 49.86,58.03 50.24,58.1 | 50.24,58.1 | 49.86,58.03 50.24,58.1 | 50.24,58.1 | 49.99,58.4 | 49.86,58.03 50.24,58.1 | v50.2,58.32 50.24,58.1 | 49.86,58.03 49.99,58.4 | v50.2,58.32 49.99,58.4 | 46.17,50.6 46.51,50.8 | v46.62,50.6 46.51,50.8 | 46.17,50.6 46.51,50.4 v46.62,50.6 | 46.17,50.6 46.51,50.8 | v46.62,50.6 46.51,50.8 | 40.32,50.59 39.98,50.79 v39.87,50.59 | 40.32,50.59 39.98,50.4 v39.87,50.59 | 49.86,58.03 49.99,58.4 | 49.99,58.4 | 49.86,58.03 50.24,58.1 | 49.86,58.03 | 49.86,58.03 49.99,58.4 | v50.2,58.32 49.99,58.4 | 49.86,58.03 50.24,58.1 | v50.2,58.32 50.24,58.1 | 49.86,58.03 49.99,58.4 | 49.86,58.03 50.24,58.1 | v50.2,58.32 50.24,58.1 | 49.86,58.03 49.99,58.4 | v50.2,58.32 49.99,58.4 | 47.41,55.6 47.03,55.5 v47.09,55.28 | 47.41,55.6 47.31,55.22 v47.09,55.28
GL2A  (via drill 0.3)
  Top 0.254: R19.2 44.22,56.39 44.72,56.82 | 44.72,56.82 v45.06,57.12 | v45.07,60.97 44.89,61.38 | 44.89,61.38 44.78,61.62 U$2.P$4 | 44.72,56.82 | 44.72,56.82 45.1,56.89 | 45.1,56.89 | 44.72,56.82 | 44.89,61.38 45.2,61.15 | v45.07,60.97 45.2,61.15 | 44.72,56.82 44.84,57.19 | 44.84,57.19 | 44.72,56.82 45.1,56.89 | 45.1,56.89 | v45.06,57.12 45.1,56.89 | 44.72,56.82 44.84,57.19 | v45.06,57.12 44.84,57.19 | 44.72,56.82 45.1,56.89 | v45.06,57.12 45.1,56.89 | 44.72,56.82 44.84,57.19 | v45.06,57.12 44.84,57.19 | 44.89,61.38 44.84,61 v45.07,60.97 | 44.89,61.38 45.2,61.15 | v45.07,60.97 45.2,61.15
  Bottom 0.254: v45.06,57.12 45.07,60.52 | 45.07,60.52 v45.07,60.97 | 45.07,60.52 44.87,60.86 | v45.07,60.97 44.87,60.86 | 45.06,57.57 44.86,57.23 | v45.06,57.12 44.86,57.23 | 45.06,57.57 44.86,57.23 | v45.06,57.12 44.86,57.23 | 45.06,57.57 45.25,57.23 v45.06,57.12 | 45.07,60.52 45.26,60.86 v45.07,60.97 | 45.07,60.52 44.87,60.86 | v45.07,60.97 44.87,60.86
GL2B  (via drill 0.2, 0.3, 0.6)
  Top 0.254: v55.65,54.36 55.65,55.26 | 55.65,55.26 55.65,68.87 | 55.65,68.87 | 55.65,68.87 v55.65,69.32 | 60.36,54.36 60.73,54.36 R17.1 | 60.36,54.36 v59.46,54.36 | U$2.P$35 44.77,75.24 | 44.77,75.24 44.77,75.39 v44.94,75.48 | 55.65,55.26 55.3,54.51 | 60.36,54.36 59.61,54.01 | 55.3,54.51 | 59.61,54.7 | 59.61,54.01 | 44.77,75.24 45,75.32 v44.94,75.48 | 44.77,75.24 44.77,75.48 v44.94,75.48 | 55.65,68.87 55.84,69.21 | 55.65,68.87 | 55.65,68.87 55.84,69.21 | v55.65,69.32 55.84,69.21 | 55.65,68.87 | 55.65,68.87 55.45,69.21 | 55.65,68.87 55.84,69.21 | 55.65,68.87 | 55.65,68.87 55.45,69.21 | v55.65,69.32 55.45,69.21 | 55.65,68.87 55.84,69.21 | 55.65,68.87 55.45,69.21 | 55.65,68.87 55.84,69.21 | v55.65,69.32 55.84,69.21 | 55.65,68.87 55.45,69.21 | v55.65,69.32 55.45,69.21 | 55.65,68.87 55.84,69.21 | v55.65,69.32 55.84,69.21 | 55.65,68.87 55.45,69.21 | v55.65,69.32 55.45,69.21 | 55.65,55.26 | 55.65,55.26 | 55.65,55.26 55.3,54.51 | v55.65,54.36 55.3,54.51 | 55.65,55.26 | 55.65,55.26 55.99,54.51 | 55.65,55.26 55.3,54.51 | 55.65,55.26 55.99,54.51 | 55.99,54.51 | 55.65,55.26 55.3,54.51 | 55.3,54.51 | v55.65,54.36 55.3,54.51 | 55.65,55.26 55.99,54.51 | v55.65,54.36 55.99,54.51 | 55.65,55.26 55.3,54.51 | v55.65,54.36 55.3,54.51 | 55.65,55.26 55.99,54.51 | v55.65,54.36 55.99,54.51 | 60.36,54.36 59.61,54.7 | 60.36,54.36 | 60.36,54.36 | 60.36,54.36 59.61,54.7 | v59.46,54.36 59.61,54.7 | 60.36,54.36 | 60.36,54.36 59.61,54.01 | v59.46,54.36 59.61,54.01 | 60.36,54.36 59.61,54.7 | 60.36,54.36 59.61,54.01 | 60.36,54.36 59.61,54.7 | v59.46,54.36 59.61,54.7 | 60.36,54.36 59.61,54.01 | v59.46,54.36 59.61,54.01
  Bottom 0.254: 45.15,75.27 50.85,69.36 v55.65,69.32 | 45.15,75.27 | 45.15,75.27 v44.94,75.48 | v59.46,54.36 58.56,54.36 | 58.56,54.36 56.55,54.36 | 56.55,54.36 v55.65,54.36 | 45.15,75.27 45.12,75.51 | 45.15,75.27 | 56.55,54.36 55.8,54.01 | 58.56,54.36 59.3,54.01 | 45.15,75.27 | 45.15,75.27 45.12,75.51 | 45.15,75.27 44.91,75.31 | 44.91,75.31 | 55.8,54.7 | 55.8,54.01 | 59.3,54.01 | 44.72,75.68 44.77,75.9 44.96,75.78 | 44.72,75.68 44.71,75.66 v44.94,75.48 | 44.96,75.78 44.97,75.77 v44.94,75.48 | 45.15,75.27 45.12,75.51 | v44.94,75.48 45.12,75.51 | 45.15,75.27 44.91,75.31 | v44.94,75.48 44.91,75.31 | 44.72,75.68 44.77,75.44 v44.94,75.48 | 44.72,75.68 44.96,75.66 v44.94,75.48 | 44.96,75.78 44.81,75.59 v44.94,75.48 | 44.96,75.78 45.09,75.58 v44.94,75.48 | 45.15,75.27 45.12,75.51 | v44.94,75.48 45.12,75.51 | 45.15,75.27 44.91,75.31 | v44.94,75.48 44.91,75.31 | 55.2,69.33 55.53,69.13 | v55.65,69.32 55.53,69.13 | 55.53,69.52 | v55.65,69.32 55.53,69.52 | 55.2,69.33 55.53,69.13 | v55.65,69.32 55.53,69.13 | 55.2,69.33 55.53,69.52 | v55.65,69.32 55.53,69.52 | 56.55,54.36 55.8,54.7 | 56.55,54.36 | 56.55,54.36 | 56.55,54.36 55.8,54.7 | v55.65,54.36 55.8,54.7 | 56.55,54.36 | 56.55,54.36 55.8,54.01 | v55.65,54.36 55.8,54.01 | 56.55,54.36 55.8,54.7 | 56.55,54.36 55.8,54.01 | 56.55,54.36 55.8,54.7 | v55.65,54.36 55.8,54.7 | 56.55,54.36 55.8,54.01 | v55.65,54.36 55.8,54.01 | 58.56,54.36 | 58.56,54.36 | 58.56,54.36 59.3,54.01 | v59.46,54.36 59.3,54.01 | 58.56,54.36 | 58.56,54.36 59.3,54.7 | 58.56,54.36 59.3,54.01 | 58.56,54.36 59.3,54.7 | 59.3,54.7 | 58.56,54.36 59.3,54.01 | 59.3,54.01 | v59.46,54.36 59.3,54.01 | 58.56,54.36 59.3,54.7 | v59.46,54.36 59.3,54.7 | 58.56,54.36 59.3,54.01 | v59.46,54.36 59.3,54.01 | 58.56,54.36 59.3,54.7
  Bottom 0.254: v59.46,54.36 59.3,54.7
GND  (via drill 0.3)
  Top 0.254: 69.36,73.11 69.36,70.87 C2.2 71.46,72.55 C3.- 79.12,69.9 79.57,69.9 | 69.36,73.11 v69.37,73.56 | v53.43,73.58 53.11,73.9 | 53.11,73.9 | 53.11,73.9 52.27,74.71 U$2.P$20 | U$2.P$18 51.77,68.77 53.04,70.04 | 53.04,70.04 v53.36,70.36 | JP1.8 21.61,75.44 21.61,74.93 JP1.6 21.61,72.9 21.61,72.39 JP1.4 21.61,70.36 21.61,69.85 JP1.2 | 79.57,69.9 | 79.57,69.9 v80.02,69.9 | v90.72,69.9 90.63,69.81 90.63,69.46 | 90.63,69.46 R1.1 | C4.- 80.02,66.19 80.02,69.45 | 80.02,69.45 | 80.02,69.45 v80.02,69.9 | LED1.C 95.42,27.73 C5.2 94.19,25.21 94.32,25.09 90.57,25.09 89.82,25.84 89.82,32.59 90.52,33.29 92.63,33.29 R3.2 90.86,35.06 | 90.86,35.06 90.62,35.3 v90.62,35.44 | 69.36,73.11 69.56,73.45 | v69.37,73.56 69.56,73.45 | 53.11,73.9 | 53.11,73.9 53.49,73.8 | 90.86,35.06 90.84,35.45 | 90.86,35.06 | 90.86,35.06 90.51,35.23 | 90.51,35.23 | 53.11,73.9 53.21,73.52 | 53.21,73.52 | 53.11,73.9 | 53.11,73.9 53.49,73.8 | 90.86,35.06 | 69.36,73.11 69.56,73.45 | v69.37,73.56 69.56,73.45 | 69.36,73.11 69.17,73.45 v69.37,73.56 | 53.11,73.9 53.21,73.52 | v53.43,73.58 53.21,73.52 | 53.11,73.9 53.49,73.8 | v53.43,73.58 53.49,73.8 | v53.43,73.58 53.54,73.78 53.88,73.58 53.54,73.39 v53.43,73.58 | 53.11,73.9 53.21,73.52 | v53.43,73.58 53.21,73.52 | 53.11,73.9 53.49,73.8 | v53.43,73.58 53.49,73.8 | 53.04,70.04 53.42,70.14 v53.36,70.36 | 53.04,70.04 53.14,70.42 v53.36,70.36 | 79.57,69.9 79.91,70.1 | 80.02,69.45 80.22,69.79 | 79.57,69.9 | 79.57,69.9 79.91,69.7 | v80.02,69.9 79.91,69.7 | 79.57,69.9 79.91,70.1 | 79.57,69.9 | 79.57,69.9 79.91,69.7 | 79.57,69.9 | 79.57,69.9 79.91,70.1 | v80.02,69.9 79.91,70.1 | 80.02,69.45 | 80.02,69.45 80.22,69.79 | v80.02,69.9 80.22,69.79 | 80.02,69.45 | 80.02,69.45 79.82,69.79
  Top 0.254: 80.02,69.45 80.22,69.79 | 80.02,69.45 | 80.02,69.45 79.82,69.79 | v80.02,69.9 79.82,69.79 | 79.57,69.9 79.91,69.7 | v80.02,69.9 79.91,69.7 | 79.57,69.9 79.91,70.1 | v80.02,69.9 79.91,70.1 | 79.57,69.9 79.91,69.7 | 79.57,69.9 79.91,70.1 | 79.57,69.9 79.91,69.7 | v80.02,69.9 79.91,69.7 | 79.57,69.9 79.91,70.1 | v80.02,69.9 79.91,70.1 | 80.02,69.45 80.22,69.79 | 80.02,69.45 79.82,69.79 | 80.02,69.45 80.22,69.79 | v80.02,69.9 80.22,69.79 | 80.02,69.45 79.82,69.79 | v80.02,69.9 79.82,69.79 | 80.02,69.45 80.22,69.79 | v80.02,69.9 80.22,69.79 | 80.02,69.45 79.82,69.79 | v80.02,69.9 79.82,69.79 | 90.63,69.46 90.89,69.75 v90.72,69.9 | 90.63,69.46 90.51,69.83 v90.72,69.9 | 90.86,35.06 90.84,35.45 | 90.84,35.45 | v90.62,35.44 90.84,35.45 | 90.86,35.06 90.51,35.23 | 90.86,35.06 90.84,35.45 | v90.62,35.44 90.84,35.45 | 90.86,35.06 90.51,35.23 | v90.62,35.44 90.51,35.23
  Top 0.406: JP1.2 20.96,68.05 | 20.96,68.05 18.84,65.51 J1.1 | v53.77,64.05 54.09,64.37 | 54.09,64.37 54.32,64.6 54.32,66.55 53.36,67.51 53.36,69.91 | 53.36,69.91 v53.36,70.36 | 21.77,68.3 | JP1.2 21.77,68.3 | 53.36,69.91 53.5,70.31 | 53.5,70.31 | 53.36,69.91 53.5,70.31 | v53.36,70.36 53.5,70.31 | 53.36,69.91 | 53.36,69.91 53.22,70.31 | 53.22,70.31 | 53.36,69.91 53.22,70.31 | v53.36,70.36 53.22,70.31 | 53.36,69.91 53.22,70.31 | 53.22,70.31 | 53.36,69.91 53.5,70.31 | 53.5,70.31 | v53.36,70.36 53.5,70.31 | 53.36,69.91 53.22,70.31 | v53.36,70.36 53.22,70.31 | 53.36,69.91 53.5,70.31 | v53.36,70.36 53.5,70.31 | 53.36,69.91 53.22,70.31 | v53.36,70.36 53.22,70.31 | 54.09,64.37 53.71,64.19 v53.77,64.05 | 54.09,64.37 53.91,63.98 v53.77,64.05 | 20.96,68.05 21.77,68.3 | JP1.2 21.77,68.3 | 20.96,68.05 21.05,68.9 JP1.2
  Top 0.508: 21.17,69.09 | 21.61,69.85 | 21.61,69.85 22.05,69.09 | 21.17,69.09 | 21.61,69.85 21.17,69.09 | 21.17,69.09 | JP1.2 21.17,69.09 | 21.61,69.85 22.05,69.09 | 22.05,69.09 | JP1.2 22.05,69.09 | 21.17,71.63 | 21.61,72.39 | 21.61,72.39 22.05,71.63 | 21.61,70.36 | 21.17,71.63 | 21.61,72.39 21.17,71.63 | 21.17,71.63 | JP1.4 21.17,71.63 | 21.61,72.39 22.05,71.63 | 22.05,71.63 | JP1.4 22.05,71.63 | 21.61,70.36 22.05,71.12 | 22.05,71.12 | 22.05,71.12 | JP1.4 22.05,71.12 | 21.61,70.36 21.17,71.12 | JP1.4 21.17,71.12 | 21.17,74.17 | 21.61,74.93 | 21.61,74.93 22.05,74.17 | 21.61,72.9 | 21.17,74.17 | 21.61,74.93 21.17,74.17 | 21.17,74.17 | JP1.6 21.17,74.17 | 21.61,74.93 22.05,74.17 | 22.05,74.17 | JP1.6 22.05,74.17 | 21.61,72.9 22.05,73.66 | 22.05,73.66 | 22.05,73.66 | JP1.6 22.05,73.66 | 21.61,72.9 21.17,73.66 | JP1.6 21.17,73.66 | 21.61,75.44 | 21.61,75.44 22.05,76.2 | 22.05,76.2 | 22.05,76.2 | JP1.8 22.05,76.2 | 21.61,75.44 21.17,76.2 | JP1.8 21.17,76.2 | 21.61,69.85 | 21.61,69.85 21.17,69.09 | JP1.2 21.17,69.09 | 21.61,69.85 22.05,69.09 | 22.05,69.09 | 21.61,69.85 | 21.61,69.85 21.17,69.09 | 21.17,69.09 | 21.17,69.09 | JP1.2 21.17,69.09 | 21.61,69.85 22.05,69.09 | 22.05,69.09 | JP1.2 22.05,69.09 | 21.61,69.85 21.17,69.09 | JP1.2 21.17,69.09 | 21.61,69.85 22.05,69.09 | 22.05,69.09 | JP1.2 22.05,69.09 | 21.61,69.85 21.17,69.09 | JP1.2 21.17,69.09 | 21.61,69.85 22.05,69.09 | JP1.2 22.05,69.09 | 21.61,72.39 | 21.61,72.39 21.17,71.63 | JP1.4 21.17,71.63 | 21.61,72.39 22.05,71.63 | 22.05,71.63 | 21.61,70.36 22.05,71.12 | 22.05,71.12 | 21.61,72.39 | 21.17,71.12 | 21.61,72.39 21.17,71.63 | 21.17,71.63 | 21.17,71.63 | JP1.4 21.17,71.63 | 21.61,72.39 22.05,71.63 | 22.05,71.63 | JP1.4 22.05,71.63 | 21.61,72.39 21.17,71.63 | JP1.4 21.17,71.63 | 21.61,72.39 22.05,71.63
  Top 0.508: 22.05,71.63 | JP1.4 22.05,71.63 | 21.61,72.39 21.17,71.63 | JP1.4 21.17,71.63 | 21.61,72.39 22.05,71.63 | JP1.4 22.05,71.63 | 21.61,70.36 22.05,71.12 | JP1.4 22.05,71.12 | 21.61,70.36 | 21.17,71.12 | JP1.4 21.17,71.12 | 21.61,70.36 22.05,71.12 | JP1.4 22.05,71.12 | 21.61,70.36 | 21.61,70.36 21.17,71.12 | JP1.4 21.17,71.12 | 21.61,70.36 22.05,71.12 | JP1.4 22.05,71.12 | 21.61,70.36 21.17,71.12 | JP1.4 21.17,71.12 | 21.61,74.93 | 21.61,74.93 21.17,74.17 | JP1.6 21.17,74.17 | 21.61,74.93 22.05,74.17 | 22.05,74.17 | 21.61,72.9 22.05,73.66 | 22.05,73.66 | 21.61,74.93 | 21.17,73.66 | 21.61,74.93 21.17,74.17 | 21.17,74.17 | 21.17,74.17 | JP1.6 21.17,74.17 | 21.61,74.93 22.05,74.17 | 22.05,74.17 | JP1.6 22.05,74.17 | 21.61,74.93 21.17,74.17 | JP1.6 21.17,74.17 | 21.61,74.93 22.05,74.17 | 22.05,74.17 | JP1.6 22.05,74.17 | 21.61,74.93 21.17,74.17 | JP1.6 21.17,74.17 | 21.61,74.93 22.05,74.17 | JP1.6 22.05,74.17 | 21.61,72.9 22.05,73.66 | JP1.6 22.05,73.66 | 21.61,72.9 | 21.17,73.66 | JP1.6 21.17,73.66 | 21.61,72.9 22.05,73.66 | JP1.6 22.05,73.66 | 21.61,72.9 | 21.61,72.9 21.17,73.66 | JP1.6 21.17,73.66 | 21.61,72.9 22.05,73.66 | JP1.6 22.05,73.66 | 21.61,72.9 21.17,73.66 | JP1.6 21.17,73.66 | 21.61,75.44 22.05,76.2 | 22.05,76.2 | 21.17,76.2 | 21.61,75.44 22.05,76.2 | JP1.8 22.05,76.2 | 21.61,75.44 | 21.17,76.2 | JP1.8 21.17,76.2 | 21.61,75.44 22.05,76.2 | JP1.8 22.05,76.2 | 21.61,75.44 | 21.61,75.44 21.17,76.2 | JP1.8 21.17,76.2 | 21.61,75.44 22.05,76.2 | JP1.8 22.05,76.2 | 21.61,75.44 21.17,76.2 | JP1.8 21.17,76.2
  Bottom 0.254: v69.37,73.56 53.88,73.58 | 53.88,73.58 v53.43,73.58 | v53.36,70.36 53.42,73.13 | 53.42,73.13 v53.43,73.58 | v80.02,69.9 80.47,69.9 | 80.47,69.9 | 80.47,69.9 90.27,69.9 | 90.27,69.9 | 90.27,69.9 v90.72,69.9 | X1.6 97.96,65.36 | 97.96,65.36 | 97.96,65.36 97.96,64.63 | 97.96,64.63 | 97.96,64.63 X1.7 97.96,62.59 | 97.96,62.59 | 97.96,62.59 97.96,61.87 | 97.96,61.87 | 97.96,61.87 X1.8 97.96,59.83 | 97.96,59.83 | 97.96,59.83 97.96,59.1 | 97.96,59.1 | 97.96,59.1 X1.9 97.96,57.06 | v90.62,35.44 90.61,35.89 | 90.61,35.89 90.57,46.88 93.22,51.85 94.87,53.5 97.72,53.5 97.96,53.74 97.96,57.06 | 97.96,57.06 | 68.92,73.56 69.25,73.37 | v69.37,73.56 69.25,73.37 | 68.92,73.56 69.25,73.76 | v69.37,73.56 69.25,73.76 | 68.92,73.56 69.25,73.37 | v69.37,73.56 69.25,73.37 | 68.92,73.56 69.25,73.76 | v69.37,73.56 69.25,73.76 | 53.88,73.58 53.54,73.78 v53.43,73.58 | 53.88,73.58 53.54,73.39 v53.43,73.58 | 53.42,73.13 53.62,73.46 v53.43,73.58 | 53.42,73.13 53.23,73.47 v53.43,73.58 | 53.37,70.81 53.17,70.48 | v53.36,70.36 53.17,70.48 | 53.37,70.81 53.17,70.48 | v53.36,70.36 53.17,70.48 | 53.37,70.81 53.56,70.47 v53.36,70.36 | 80.47,69.9 80.13,70.1 | 80.47,69.9 | 80.47,69.9 80.13,70.1 | v80.02,69.9 80.13,70.1 | 80.47,69.9 | 80.47,69.9 80.13,69.7 | 80.47,69.9 80.13,70.1 | 80.47,69.9 | 80.47,69.9 80.13,69.7 | v80.02,69.9 80.13,69.7 | 80.47,69.9 80.13,70.1 | 80.47,69.9 80.13,69.7 | 80.47,69.9 80.13,70.1 | v80.02,69.9 80.13,70.1 | 80.47,69.9 80.13,69.7 | v80.02,69.9 80.13,69.7 | 80.47,69.9 80.13,70.1 | v80.02,69.9 80.13,70.1 | 80.47,69.9 80.13,69.7 | v80.02,69.9 80.13,69.7 | 90.27,69.9 90.61,70.1 | 90.27,69.9 | 90.27,69.9 90.61,69.7 | v90.72,69.9 90.61,69.7 | 90.27,69.9 90.61,70.1 | 90.27,69.9 | 90.27,69.9 90.61,69.7
  Bottom 0.254: 90.27,69.9 | 90.27,69.9 90.61,70.1 | v90.72,69.9 90.61,70.1 | 90.27,69.9 90.61,69.7 | v90.72,69.9 90.61,69.7 | 90.27,69.9 90.61,70.1 | v90.72,69.9 90.61,70.1 | 90.27,69.9 90.61,69.7 | 90.27,69.9 90.61,70.1 | 90.27,69.9 90.61,69.7 | v90.72,69.9 90.61,69.7 | 90.27,69.9 90.61,70.1 | v90.72,69.9 90.61,70.1 | 90.61,35.89 90.42,35.55 v90.62,35.44 | 90.61,35.89 90.81,35.55 v90.62,35.44
  Bottom 0.406: JP1.2 24.52,66.01 31.29,66.02 31.52,66 50.32,66 52.27,64.05 53.32,64.05 | 53.32,64.05 v53.77,64.05 | 53.32,64.05 53.72,63.91 | 22.34,68.13 | 53.72,63.91 | 53.32,64.05 53.72,63.91 | v53.77,64.05 53.72,63.91 | 53.32,64.05 53.72,64.19 | 53.72,64.19 | 53.32,64.05 | 53.32,64.05 53.72,64.19 | v53.77,64.05 53.72,64.19 | 53.32,64.05 53.72,63.91 | 53.72,63.91 | 53.32,64.05 53.72,63.91 | v53.77,64.05 53.72,63.91 | 53.32,64.05 53.72,64.19 | 53.72,64.19 | v53.77,64.05 53.72,64.19 | 53.32,64.05 53.72,63.91 | 53.32,64.05 53.72,64.19 | 53.32,64.05 53.72,63.91 | v53.77,64.05 53.72,63.91 | 53.32,64.05 53.72,64.19 | v53.77,64.05 53.72,64.19 | 22.34,68.13 22.16,68.95 | 22.34,68.13 | 22.34,68.13 21.51,68.28 | 22.34,68.13 22.16,68.95 | 22.34,68.13 21.51,68.28 | JP1.2 21.51,68.28 | 22.34,68.13 22.16,68.95 | JP1.2 22.16,68.95 | 22.34,68.13 21.51,68.28 | JP1.2 21.51,68.28
  Bottom 0.508: 97.96,65.36 97.45,65.92 | 97.96,65.36 98.47,65.92 | X1.6 98.47,65.92 | 97.96,65.36 97.45,65.92 | 97.96,65.36 98.47,65.92 | X1.6 98.47,65.92 | 97.96,65.36 97.45,65.92 | X1.6 97.45,65.92 | 97.96,65.36 98.47,65.92 | 97.96,65.36 | 97.96,65.36 97.45,65.92 | X1.6 97.45,65.92 | 97.96,65.36 98.47,65.92 | X1.6 98.47,65.92 | 97.96,65.36 97.45,65.92 | X1.6 97.45,65.92 | 97.96,64.63 | 97.96,64.63 97.45,64.07 | 97.96,62.59 97.45,63.15 | 97.96,64.63 97.45,64.07 | 97.96,64.63 98.47,64.07 | X1.7 98.47,64.07 | 97.96,62.59 98.47,63.15 | X1.7 98.47,63.15 | 97.96,62.59 97.45,63.15 | 97.96,64.63 97.45,64.07 | X1.7 97.45,64.07 | 97.96,64.63 98.47,64.07 | 97.96,64.63 97.45,64.07 | X1.7 97.45,64.07 | 97.96,64.63 98.47,64.07 | X1.7 98.47,64.07 | 97.96,64.63 97.45,64.07 | X1.7 97.45,64.07 | 97.96,64.63 98.47,64.07 | X1.7 98.47,64.07 | 97.96,62.59 98.47,63.15 | X1.7 98.47,63.15 | 97.96,62.59 97.45,63.15 | X1.7 97.45,63.15 | 97.96,62.59 98.47,63.15 | 97.96,62.59 | 97.96,62.59 97.45,63.15 | X1.7 97.45,63.15 | 97.96,62.59 98.47,63.15 | X1.7 98.47,63.15 | 97.96,62.59 97.45,63.15 | X1.7 97.45,63.15 | 97.96,61.87 | 97.96,61.87 97.45,61.31 | 97.96,59.83 97.45,60.39 | 97.96,61.87 97.45,61.31 | 97.96,61.87 98.47,61.31 | X1.8 98.47,61.31 | 97.96,59.83 98.47,60.39 | X1.8 98.47,60.39 | 97.96,59.83 97.45,60.39 | 97.96,61.87 97.45,61.31 | X1.8 97.45,61.31 | 97.96,61.87 98.47,61.31 | 97.96,61.87 97.45,61.31 | X1.8 97.45,61.31 | 97.96,61.87 98.47,61.31 | X1.8 98.47,61.31 | 97.96,61.87 97.45,61.31 | X1.8 97.45,61.31 | 97.96,61.87 98.47,61.31 | X1.8 98.47,61.31 | 97.96,59.83 98.47,60.39 | X1.8 98.47,60.39 | 97.96,59.83 97.45,60.39 | X1.8 97.45,60.39 | 97.96,59.83 98.47,60.39 | 97.96,59.83 | 97.96,59.83 97.45,60.39 | X1.8 97.45,60.39 | 97.96,59.83 98.47,60.39
  Bottom 0.508: X1.8 98.47,60.39 | 97.96,59.83 97.45,60.39 | X1.8 97.45,60.39 | 97.96,59.1 | 97.96,59.1 97.45,58.54 | 97.96,57.06 97.45,57.62 | 97.96,59.1 97.45,58.54 | 97.96,59.1 98.47,58.54 | X1.9 98.47,58.54 | 97.96,57.06 98.47,57.62 | X1.9 98.47,57.62 | 97.96,57.06 97.45,57.62 | 97.96,59.1 97.45,58.54 | X1.9 97.45,58.54 | 97.96,59.1 98.47,58.54 | 97.96,59.1 97.45,58.54 | X1.9 97.45,58.54 | 97.96,59.1 98.47,58.54 | X1.9 98.47,58.54 | 97.96,59.1 97.45,58.54 | X1.9 97.45,58.54 | 97.96,59.1 98.47,58.54 | X1.9 98.47,58.54 | 97.96,57.06 98.47,57.62 | X1.9 98.47,57.62 | 97.96,57.06 97.45,57.62 | X1.9 97.45,57.62 | 97.96,57.06 98.47,57.62 | 97.96,57.06 | 97.96,57.06 97.45,57.62 | X1.9 97.45,57.62 | 97.96,57.06 98.47,57.62 | X1.9 98.47,57.62 | 97.96,57.06 97.45,57.62 | X1.9 97.45,57.62
  pour Bottom: 0.27,78.74 0.27,62.74 -0.23,-0.34 30.61,-0.25 84.29,-0.23 95.92,-0.19 101.66,-0.27 104.17,0 104.41,0.25 104.67,4.06 104.67,78.74
LSS1  (via drill 0.3)
  Top 0.254: R24.1 v49.42,55.22 | v51.93,57.91 50.79,58.76 U$2.P$16 | 49.14,54.87 49.5,55.01 | v49.42,55.22 49.5,55.01 | 49.14,54.87 49.5,55.01 | v49.42,55.22 49.5,55.01 | 49.14,54.87 49.2,55.26 v49.42,55.22 | v51.93,57.91 51.72,57.83 51.57,58.18 51.96,58.14 v51.93,57.91
  Bottom 0.254: v49.42,55.22 51.62,57.59 | 51.62,57.59 v51.93,57.91 | v49.42,55.22 49.36,55.44 49.73,55.55 49.64,55.17 v49.42,55.22 | 51.62,57.59 52,57.7 v51.93,57.91 | 51.62,57.59 51.71,57.96 v51.93,57.91
LSS2
  Top 0.254: R25.1 75.27,54.57 58.69,71.24 58.69,76.45 58.68,78.24 46.97,78.24 45.77,75.69 45.77,73.64 U$2.P$33
MS1  (via drill 0.2, 0.3)
  Top 0.254: JP1.1 25.17,68.83 28.38,68.83 R8.1 v26.29,67.47 | U$2.P$28 48.28,74.71 48.28,75.07 47.91,75.45 | 47.91,75.45 v47.7,75.67 | 47.91,75.45 47.87,75.69 | 47.87,75.69 | v47.7,75.67 47.87,75.69 | 47.91,75.45 47.67,75.5 | v47.7,75.67 47.67,75.5 | 47.91,75.45 47.87,75.69 | v47.7,75.67 47.87,75.69 | 47.91,75.45 47.67,75.5 | v47.7,75.67 47.67,75.5 | 26.7,67.66 26.48,67.34 | v26.29,67.47 26.48,67.34 | 26.7,67.66 26.31,67.69 v26.29,67.47 | 26.7,67.66 26.48,67.34 | v26.29,67.47 26.48,67.34
  Top 0.508: 25.17,68.83 | 25.17,68.83 24.4,69.27 | 24.4,68.39 | 25.17,68.83 24.4,69.27 | 24.4,69.27 | JP1.1 24.4,69.27 | 25.17,68.83 24.4,68.39 | 24.4,68.39 | JP1.1 24.4,68.39 | 25.17,68.83 24.4,69.27 | 24.4,69.27 | 25.17,68.83 24.4,68.39 | JP1.1 24.4,68.39 | 24.4,69.27 | 24.4,68.39 | 25.17,68.83 24.4,69.27 | JP1.1 24.4,69.27 | 25.17,68.83 | 24.4,68.39 | JP1.1 24.4,68.39 | 25.17,68.83 24.4,69.27 | JP1.1 24.4,69.27 | 25.17,68.83 | 25.17,68.83 24.4,68.39 | JP1.1 24.4,68.39 | 25.17,68.83 24.4,69.27 | JP1.1 24.4,69.27 | 25.17,68.83 24.4,68.39 | JP1.1 24.4,68.39
  Bottom 0.254: v47.7,75.67 47.44,75.83 | 47.44,75.83 45.12,77.25 26.29,77.27 26.29,67.92 | 26.29,67.92 | 26.29,67.92 v26.29,67.47 | 47.44,75.83 47.54,75.6 | v47.7,75.67 47.54,75.6 | 47.44,75.83 47.69,75.85 | 47.69,75.85 | v47.7,75.67 47.69,75.85 | 47.54,75.6 | 47.44,75.83 47.54,75.6 | v47.7,75.67 47.54,75.6 | 47.44,75.83 47.54,75.6 | v47.7,75.67 47.54,75.6 | 47.44,75.83 47.69,75.85 | v47.7,75.67 47.69,75.85 | 26.29,67.92 26.49,67.58 | 26.29,67.92 | 26.29,67.92 26.09,67.58 | v26.29,67.47 26.09,67.58 | 26.29,67.92 26.49,67.58 | 26.29,67.92 | 26.29,67.92 26.09,67.58 | 26.29,67.92 | 26.29,67.92 26.49,67.58 | v26.29,67.47 26.49,67.58 | 26.29,67.92 26.09,67.58 | v26.29,67.47 26.09,67.58 | 26.29,67.92 26.49,67.58 | v26.29,67.47 26.49,67.58 | 26.29,67.92 26.09,67.58 | 26.29,67.92 26.49,67.58 | 26.29,67.92 26.09,67.58 | v26.29,67.47 26.09,67.58 | 26.29,67.92 26.49,67.58 | v26.29,67.47 26.49,67.58
MS2  (via drill 0.3)
  Top 0.254: JP1.3 25.17,71.37 R9.1 28.63,70.45 | U$2.P$29 47.77,72.1 48.94,72.1 | 48.94,72.1 | 48.94,72.1 v49.39,72.1 | v50.97,70.45 50.53,70.34 | 50.53,70.34 47.91,69.7 33.8,69.71 33.49,70.02 32.31,70.02 | 32.31,70.02 | 32.31,70.02 v31.86,70.02 | v28.63,70 28.63,70.45 | 48.94,72.1 49.28,72.3 | 48.94,72.1 | 48.94,72.1 49.28,71.9 | v49.39,72.1 49.28,71.9 | 48.94,72.1 49.28,72.3 | 48.94,72.1 | 48.94,72.1 49.28,71.9 | 48.94,72.1 | 48.94,72.1 49.28,72.3 | v49.39,72.1 49.28,72.3 | 48.94,72.1 49.28,71.9 | v49.39,72.1 49.28,71.9 | 48.94,72.1 49.28,72.3 | v49.39,72.1 49.28,72.3 | 48.94,72.1 49.28,71.9 | 48.94,72.1 49.28,72.3 | 48.94,72.1 49.28,71.9 | v49.39,72.1 49.28,71.9 | 48.94,72.1 49.28,72.3 | v49.39,72.1 49.28,72.3 | 50.53,70.34 50.91,70.23 v50.97,70.45 | 50.53,70.34 50.81,70.61 v50.97,70.45 | 32.31,70.02 31.97,70.22 | 32.31,70.02 | 32.31,70.02 31.97,70.22 | v31.86,70.02 31.97,70.22 | 32.31,70.02 | 32.31,70.02 31.97,69.82 | 32.31,70.02 31.97,70.22 | 32.31,70.02 | 32.31,70.02 31.97,69.82 | v31.86,70.02 31.97,69.82 | 32.31,70.02 31.97,70.22 | 32.31,70.02 31.97,69.82 | 32.31,70.02 31.97,70.22 | v31.86,70.02 31.97,70.22 | 32.31,70.02 31.97,69.82 | v31.86,70.02 31.97,69.82 | 32.31,70.02 31.97,70.22 | v31.86,70.02 31.97,70.22 | 32.31,70.02 31.97,69.82 | v31.86,70.02 31.97,69.82 | 28.63,70.45 28.43,70.11 v28.63,70 | 28.63,70.45 28.83,70.11 v28.63,70
  Top 0.508: 25.17,71.37 | 25.17,71.37 24.4,71.81 | 24.4,70.93 | 25.17,71.37 24.4,71.81 | 24.4,71.81 | JP1.3 24.4,71.81 | 25.17,71.37 24.4,70.93 | 24.4,70.93 | JP1.3 24.4,70.93 | 25.17,71.37 24.4,71.81 | 24.4,71.81 | 25.17,71.37 24.4,70.93 | JP1.3 24.4,70.93 | 24.4,71.81 | 24.4,70.93 | 25.17,71.37 24.4,71.81 | JP1.3 24.4,71.81 | 25.17,71.37 | 24.4,70.93 | JP1.3 24.4,70.93 | 25.17,71.37 24.4,71.81 | JP1.3 24.4,71.81 | 25.17,71.37 | 25.17,71.37 24.4,70.93 | JP1.3 24.4,70.93 | 25.17,71.37 24.4,71.81 | JP1.3 24.4,71.81 | 25.17,71.37 24.4,70.93 | JP1.3 24.4,70.93
  Bottom 0.254: v49.39,72.1 49.7,71.78 | 49.7,71.78 50.66,70.78 | 50.66,70.78 v50.97,70.45 | v31.86,70.02 31.41,70.02 | 31.41,70.02 v28.63,70 | 49.7,71.78 49.61,72.15 | v49.39,72.1 49.61,72.15 | 51.03,70.67 | v50.97,70.45 51.03,70.67 | 31.41,70.02 31.75,70.22 | v31.86,70.02 31.75,70.22 | 49.7,71.78 49.61,72.15 | v49.39,72.1 49.61,72.15 | 49.7,71.78 49.33,71.88 v49.39,72.1 | 50.66,70.78 50.75,70.4 v50.97,70.45 | 50.66,70.78 51.03,70.67 | v50.97,70.45 51.03,70.67 | 31.41,70.02 31.75,69.82 v31.86,70.02 | 31.41,70.02 31.75,70.22 | v31.86,70.02 31.75,70.22 | v28.63,70 28.74,70.2 29.08,70 28.75,69.81 v28.63,70
N$1  (via drill 0.2, 0.3)